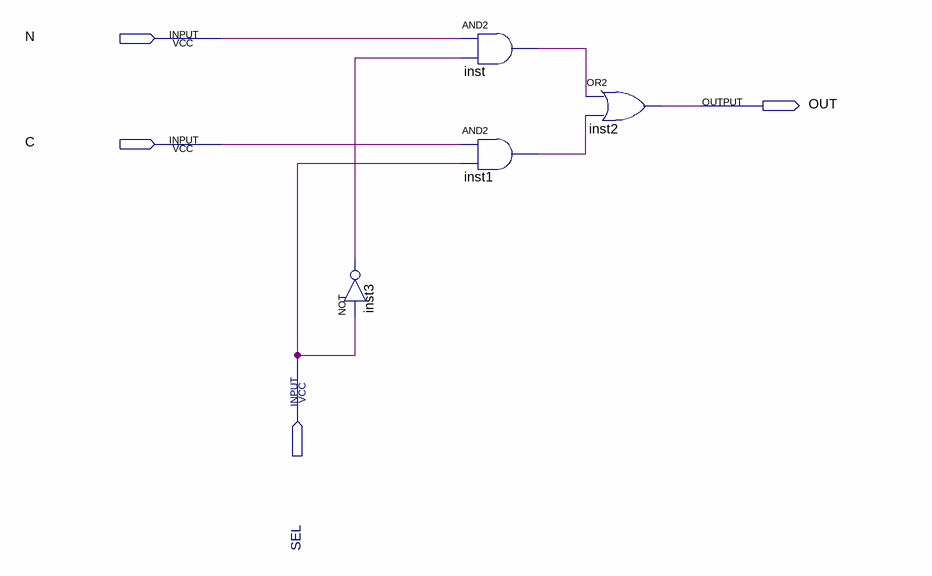
[diagram p0: schematic sheet]
// Quartus schematic Selector.bdf as structural Verilog: 4 symbols, 4 pins
module Selector (
  input  N,
  input  C,
  input  SEL,
  output OUT
);

  wire inst1_out, inst3_out, inst_out;

  not inst3 (inst3_out, SEL);
  and inst (inst_out, N, inst3_out);
  and inst1 (inst1_out, C, SEL);
  or inst2 (OUT, inst_out, inst1_out);
endmodule
